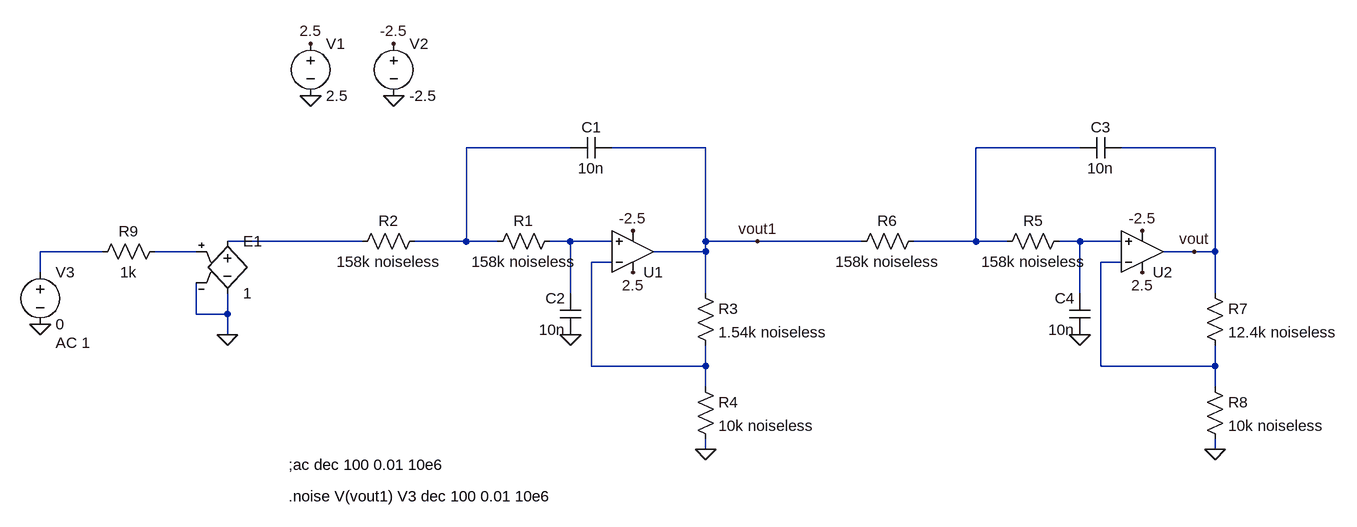
[diagram p0: schematic noise_bandwidth.asc]
noise_bandwidth.asc, the LTspice schematic file:
Version 4
SHEET 1 1576 680
WIRE 304 112 144 112
WIRE 512 112 368 112
WIRE 1088 112 928 112
WIRE 1296 112 1152 112
WIRE -16 256 -224 256
WIRE 144 256 144 112
WIRE 144 256 64 256
WIRE 192 256 144 256
WIRE 304 256 272 256
WIRE 368 256 304 256
WIRE 512 256 512 112
WIRE 592 256 512 256
WIRE 752 256 592 256
WIRE 928 256 928 112
WIRE 928 256 832 256
WIRE 976 256 928 256
WIRE 1088 256 1056 256
WIRE 1152 256 1088 256
WIRE -416 272 -512 272
WIRE -272 272 -336 272
WIRE 512 272 512 256
WIRE 512 272 432 272
WIRE 1264 272 1216 272
WIRE 1296 272 1296 112
WIRE 1296 272 1264 272
WIRE 368 288 336 288
WIRE 1152 288 1120 288
WIRE -512 304 -512 272
WIRE 304 336 304 256
WIRE 512 336 512 272
WIRE 1088 336 1088 256
WIRE 1296 336 1296 272
WIRE -272 368 -272 320
WIRE -224 368 -224 336
WIRE -224 368 -272 368
WIRE -224 400 -224 368
WIRE 336 448 336 288
WIRE 512 448 512 416
WIRE 512 448 336 448
WIRE 1120 448 1120 288
WIRE 1296 448 1296 416
WIRE 1296 448 1120 448
WIRE 512 480 512 448
WIRE 1296 480 1296 448
WIRE 512 576 512 560
WIRE 1296 576 1296 560
FLAG -96 -48 2.5
FLAG 32 -48 -2.5
FLAG -96 32 0
FLAG 32 32 0
FLAG 400 304 2.5
FLAG 400 240 -2.5
FLAG 512 576 0
FLAG 304 400 0
FLAG -512 384 0
FLAG 1184 304 2.5
FLAG 1184 240 -2.5
FLAG 1296 576 0
FLAG 1088 400 0
FLAG 1264 272 vout
FLAG -224 400 0
FLAG 592 256 vout1
SYMBOL Opamps\\UniversalOpamp2 400 272 M180
SYMATTR InstName U1
SYMBOL voltage -96 -64 R0
WINDOW 123 0 0 Left 0
WINDOW 39 0 0 Left 0
SYMATTR InstName V1
SYMATTR Value 2.5
SYMBOL voltage 32 -64 R0
WINDOW 123 0 0 Left 0
WINDOW 39 0 0 Left 0
SYMATTR InstName V2
SYMATTR Value -2.5
SYMBOL res 288 240 R90
WINDOW 0 0 56 VBottom 2
WINDOW 3 32 56 VTop 2
SYMATTR InstName R1
SYMATTR Value 158k noiseless
SYMBOL res 80 240 R90
WINDOW 0 0 56 VBottom 2
WINDOW 3 32 56 VTop 2
SYMATTR InstName R2
SYMATTR Value 158k noiseless
SYMBOL cap 368 96 R90
WINDOW 0 0 32 VBottom 2
WINDOW 3 32 32 VTop 2
SYMATTR InstName C1
SYMATTR Value 10n
SYMBOL cap 320 400 R180
WINDOW 0 24 56 Left 2
WINDOW 3 24 8 Left 2
SYMATTR InstName C2
SYMATTR Value 10n
SYMBOL res 496 320 R0
SYMATTR InstName R3
SYMATTR Value 1.54k noiseless
SYMBOL res 496 464 R0
SYMATTR InstName R4
SYMATTR Value 10k noiseless
SYMBOL voltage -512 288 R0
WINDOW 123 24 124 Left 2
WINDOW 39 0 0 Left 0
SYMATTR InstName V3
SYMATTR Value 0
SYMATTR Value2 AC 1
SYMBOL Opamps\\UniversalOpamp2 1184 272 M180
SYMATTR InstName U2
SYMBOL res 1072 240 R90
WINDOW 0 0 56 VBottom 2
WINDOW 3 32 56 VTop 2
SYMATTR InstName R5
SYMATTR Value 158k noiseless
SYMBOL res 848 240 R90
WINDOW 0 0 56 VBottom 2
WINDOW 3 32 56 VTop 2
SYMATTR InstName R6
SYMATTR Value 158k noiseless
SYMBOL cap 1152 96 R90
WINDOW 0 0 32 VBottom 2
WINDOW 3 32 32 VTop 2
SYMATTR InstName C3
SYMATTR Value 10n
SYMBOL cap 1104 400 R180
WINDOW 0 24 56 Left 2
WINDOW 3 24 8 Left 2
SYMATTR InstName C4
SYMATTR Value 10n
SYMBOL res 1280 320 R0
SYMATTR InstName R7
SYMATTR Value 12.4k noiseless
SYMBOL res 1280 464 R0
SYMATTR InstName R8
SYMATTR Value 10k noiseless
SYMBOL e -224 240 R0
SYMATTR InstName E1
SYMATTR Value 1
SYMBOL res -320 256 R90
WINDOW 0 0 56 VBottom 2
WINDOW 3 32 56 VTop 2
SYMATTR InstName R9
SYMATTR Value 1k
TEXT -130 600 Left 2 !;ac dec 100 0.01 10e6
TEXT -130 648 Left 2 !.noise V(vout1) V3 dec 100 0.01 10e6

The netlist it stands for:
* noise_bandwidth.asc
XU1 N004 N008 2.5 -2.5 vout1 level.2 Avol=1Meg GBW=10Meg Slew=10Meg ilimit=25m rail=0 Vos=0 phimargin=45 en=0 enk=0 in=0 ink=0 Rin=500Meg  ; pins IN+ IN- V+ V- OUT
V1 2.5 0 2.5
V2 -2.5 0 -2.5
R1 N004 N001 158k noiseless
R2 N001 N003 158k noiseless
C1 vout1 N001 10n
C2 0 N004 10n
R3 vout1 N008 1.54k noiseless
R4 N008 0 10k noiseless
V3 N006 0 0 AC 1
XU2 N005 N009 2.5 -2.5 vout level.2 Avol=1Meg GBW=10Meg Slew=10Meg ilimit=25m rail=0 Vos=0 phimargin=45 en=0 enk=0 in=0 ink=0 Rin=500Meg  ; pins IN+ IN- V+ V- OUT
R5 N005 N002 158k noiseless
R6 N002 vout1 158k noiseless
C3 vout N002 10n
C4 0 N005 10n
R7 vout N009 12.4k noiseless
R8 N009 0 10k noiseless
E1 N003 0 N007 0 1
R9 N007 N006 1k
;ac dec 100 0.01 10e6
.noise V(vout1) V3 dec 100 0.01 10e6
.lib UniversalOpamps2.sub
.backanno
.end